# EAGLE schematic mh_stepper_con (EAGLE 7.4.0)
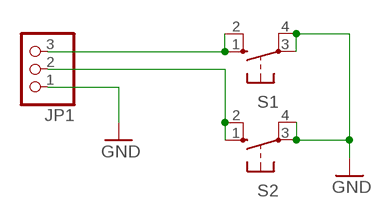
[diagram p0: schematic, sheet 1]

## Parts
JP1  PINHD-1X3  [1X03]
S1  10-XX  [B3F-10XX]
S2  10-XX  [B3F-10XX]

## Nets
GND: JP1.1 S1.3(P) S1.4(P1) S2.3(P) S2.4(P1)
N$2: JP1.3 S1.1(S) S1.2(S1)
N$3: JP1.2 S2.1(S) S2.2(S1)

## Library data of the parts
JP1 = pinhead:PINHD-1X3: PIN HEADER
S1 S2 = switch-omron:10-XX: OMRON SWITCH; MPN: B3F-1000; OC_FARNELL: 176432; OC_NEWARK: 36M3542